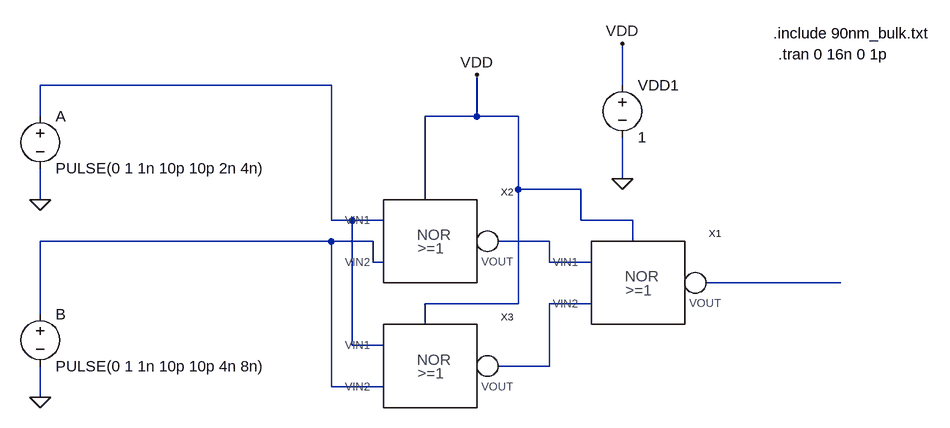
[diagram p0: schematic nor_nor_nor_main.asc]
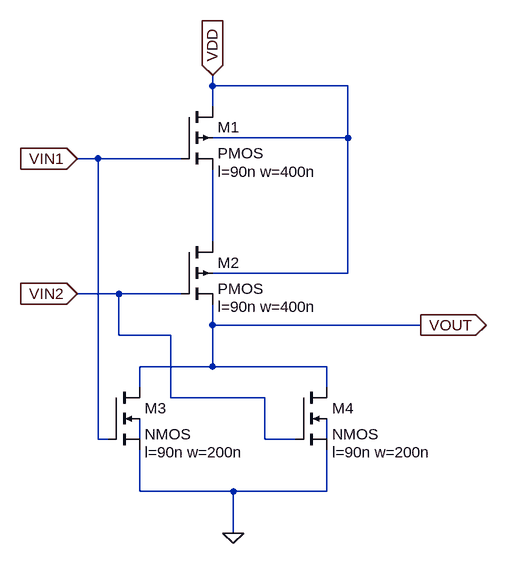
[diagram p1: sub-circuit nor.asc]
nor_nor_nor_main.asc, the LTspice schematic file:
Version 4
SHEET 1 1332 852
WIRE 304 -16 -144 -16
WIRE 752 -16 752 -80
WIRE -144 32 -144 -16
WIRE 528 32 528 -32
WIRE 528 32 448 32
WIRE 592 32 528 32
WIRE 752 128 752 64
WIRE 592 144 592 32
WIRE 688 144 592 144
WIRE -144 160 -144 112
WIRE 448 160 448 32
WIRE 304 192 304 -16
WIRE 336 192 304 192
WIRE 384 192 336 192
WIRE 688 192 688 144
WIRE 768 192 688 192
WIRE 304 224 -144 224
WIRE 368 224 304 224
WIRE 640 224 560 224
WIRE 768 224 768 192
WIRE 368 256 368 224
WIRE 384 256 368 256
WIRE 640 256 640 224
WIRE 704 256 640 256
WIRE 1088 288 880 288
WIRE 592 320 592 144
WIRE 592 320 448 320
WIRE 704 320 640 320
WIRE -144 336 -144 224
WIRE 448 352 448 320
WIRE 336 384 336 192
WIRE 384 384 336 384
WIRE 640 416 640 320
WIRE 640 416 560 416
WIRE 304 448 304 224
WIRE 384 448 304 448
WIRE -144 464 -144 416
FLAG -144 160 0
FLAG -144 464 0
FLAG 752 128 0
FLAG 752 -80 VDD
FLAG 528 -32 VDD
SYMBOL voltage -144 16 R0
WINDOW 123 0 0 Left 0
WINDOW 39 0 0 Left 0
SYMATTR InstName A
SYMATTR Value PULSE(0 1 1n 10p 10p 2n 4n)
SYMBOL voltage -144 320 R0
WINDOW 123 0 0 Left 0
WINDOW 39 0 0 Left 0
SYMATTR InstName B
SYMATTR Value PULSE(0 1 1n 10p 10p 4n 8n)
SYMBOL voltage 752 -32 R0
WINDOW 123 0 0 Left 0
WINDOW 39 0 0 Left 0
SYMATTR InstName VDD1
SYMATTR Value 1
SYMBOL nor 688 256 R0
SYMATTR InstName X1
SYMBOL nor 368 192 R0
SYMATTR InstName X2
SYMBOL nor 368 384 R0
SYMATTR InstName X3
TEXT 984 -96 Left 2 !.include 90nm_bulk.txt
TEXT 992 -64 Left 2 !.tran 0 16n 0 1p

nor.asc, the sub-circuit schematic file:
Version 4
SHEET 1 880 680
WIRE -32 -64 -32 -80
WIRE 176 -64 -32 -64
WIRE -32 -32 -32 -64
WIRE 176 16 176 -64
WIRE 176 16 -32 16
WIRE -208 48 -240 48
WIRE -80 48 -208 48
WIRE -32 176 -32 64
WIRE 176 224 176 16
WIRE 176 224 -32 224
WIRE -176 256 -240 256
WIRE -80 256 -176 256
WIRE -32 304 -32 272
WIRE 288 304 -32 304
WIRE -176 320 -176 256
WIRE -96 320 -176 320
WIRE -32 368 -32 304
WIRE -32 368 -144 368
WIRE 144 368 -32 368
WIRE -144 400 -144 368
WIRE 144 400 144 368
WIRE -96 416 -96 320
WIRE 48 416 -96 416
WIRE -208 480 -208 48
WIRE -192 480 -208 480
WIRE -144 480 -144 448
WIRE 48 480 48 416
WIRE 96 480 48 480
WIRE 144 480 144 448
WIRE -144 560 -144 496
WIRE 0 560 -144 560
WIRE 144 560 144 496
WIRE 144 560 0 560
WIRE 0 624 0 560
FLAG -32 -80 VDD
IOPIN -32 -80 In
FLAG -240 48 VIN1
IOPIN -240 48 In
FLAG -240 256 VIN2
IOPIN -240 256 In
FLAG 288 304 VOUT
IOPIN 288 304 Out
FLAG 0 624 0
SYMBOL pmos4 -80 -32 R0
WINDOW 123 56 100 Left 2
SYMATTR Value2 l=90n w=400n
SYMATTR InstName M1
SYMBOL pmos4 -80 176 R0
WINDOW 123 56 100 Left 2
SYMATTR Value2 l=90n w=400n
SYMATTR InstName M2
SYMBOL nmos4 -192 400 R0
WINDOW 123 56 100 Left 2
SYMATTR Value2 l=90n w=200n
SYMATTR InstName M3
SYMBOL nmos4 96 400 R0
WINDOW 123 56 100 Left 2
SYMATTR Value2 l=90n w=200n
SYMATTR InstName M4

The netlist it stands for:
* nor_nor_nor_main.asc
V§A N001 0 PULSE(0 1 1n 10p 10p 2n 4n)
V§B N002 0 PULSE(0 1 1n 10p 10p 4n 8n)
VDD1 VDD 0 1
XX1 N003 N005 N004 VDD nor
XX2 N001 N002 N003 VDD nor
XX3 N001 N002 N005 VDD nor

* block symbol definitions
.subckt nor VIN1 VIN2 VOUT VDD
M1 VDD VIN1 N001 VDD PMOS l=90n w=400n
M2 N001 VIN2 VOUT VDD PMOS l=90n w=400n
M3 VOUT VIN1 0 N002 NMOS l=90n w=200n
M4 VOUT VIN2 0 N003 NMOS l=90n w=200n
.ends nor

.model NMOS NMOS
.model PMOS PMOS
.lib standard.mos
.include 90nm_bulk.txt
.tran 0 16n 0 1p
.backanno
.end